# Altium project PCB_Project1.PrjPCB
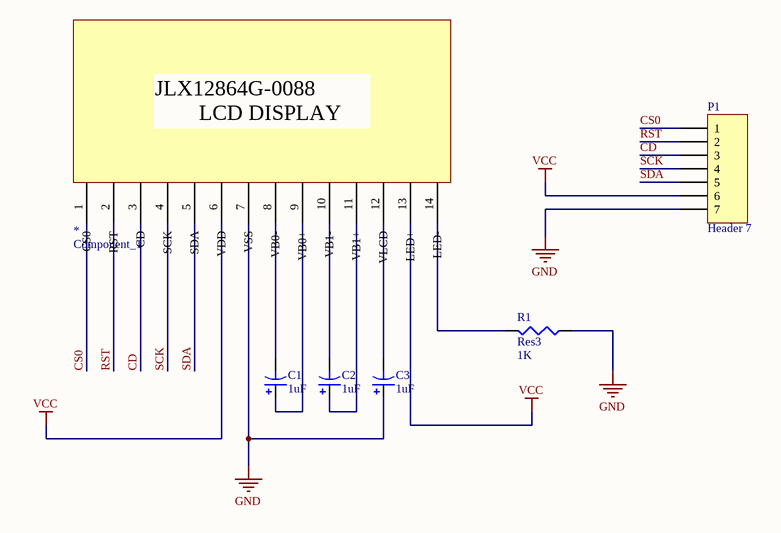
[diagram p0: Sheet1.SchDoc]
1 sheet, 6 parts. Net scope: global (net labels, ports and power ports of the same name join across sheets).
Board file: JLX12864.PcbDoc

## Sheet Sheet1.SchDoc
size A4

### Parts
*  Component_1  [PCBComponent_1]
C1  value 1uF  [C0805]  (hidden comment: Cap Pol3)
C2  value 1uF  [C0805]  (hidden comment: Cap Pol3)
C3  value 1uF  [C0805]  (hidden comment: Cap Pol3)
P1  Header 7  [HDR1X7]
R1  Res3  value 1K  [J1-0603]

### Nets
GND: *.7(VSS) C3.1 P1.7 R1.1
VCC: *.6(VDD) *.13(LED+) P1.6
CD: *.3(CD) P1.3
CS0: *.1(CS0) P1.1
RST: *.2(RST) P1.2
SCK: *.4(SCK) P1.4
SDA: *.5(SDA) P1.5
Net*_8: *.8(VB0-) C1.2
Net*_9: *.9(VB0+) C1.1
Net*_10: *.10(VB1-) C2.2
Net*_11: *.11(VB1+) C2.1
Net*_12: *.12(VLCD) C3.2
Net*_14: *.14(LED-) R1.2

### Notes on the sheet
- (in symbol Component_1) JLX12864G-0088 / LCD DISPLAY

### Library data of the parts
C1-C3 = Cap Pol3: Polarized Capacitor (Surface Mount); Published: 8-Jun-2000; LatestRevisionDate: 29-May-2009; LatestRevisionNote: IPC-7351 Footprint Added.; PackageReference: C0805; Publisher: Altium Limited; PackageDescription: Chip Capacitor
P1 = Header 7: Header, 7-Pin; LatestRevisionDate: 17-Jul-2002; LatestRevisionNote: Re-released for DXP Platform.; Publisher: Altium Limited
R1 = Res3: Resistor; Published: 8-Jun-2000; LatestRevisionDate: 29-May-2009; LatestRevisionNote: IPC-7351 Footprint Added.; PackageReference: J1-0603; Publisher: Altium Limited; PackageDescription: Chip Resistor